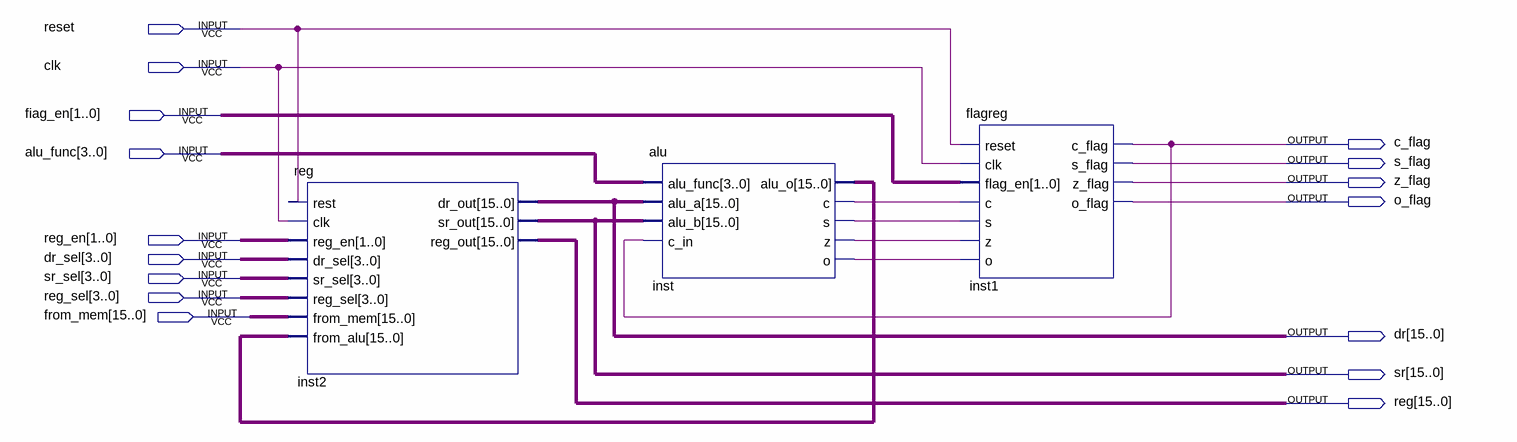
[diagram p0: schematic sheet]
// Quartus schematic exe_unit.bdf as structural Verilog: 3 symbols, 16 pins
module exe_unit (
  input  reset,
  input  clk,
  input  [1:0] fiag_en,
  input  [3:0] alu_func,
  input  [1:0] reg_en,
  input  [3:0] dr_sel,
  input  [3:0] sr_sel,
  input  [3:0] reg_sel,
  input  [15:0] from_mem,
  output c_flag,
  output s_flag,
  output z_flag,
  output o_flag,
  output [15:0] dr,
  output [15:0] sr,
  output [15:0] \reg 
);

  wire inst_c, inst_o, inst_s, inst_z;
  wire [15:0] inst_alu_o;

  \reg  inst2 (
    .rest(reset), .clk(clk), .reg_en(reg_en), .dr_sel(dr_sel), .sr_sel(sr_sel), .reg_sel(reg_sel),
    .from_mem(from_mem), .from_alu(inst_alu_o), .dr_out(dr), .sr_out(sr), .reg_out(\reg ));
  alu inst (
    .alu_func(alu_func), .alu_a(dr), .alu_b(sr), .c_in(c_flag), .alu_o(inst_alu_o), .c(inst_c), .s(inst_s),
    .z(inst_z), .o(inst_o));
  flagreg inst1 (
    .reset(reset), .clk(clk), .flag_en(fiag_en), .c(inst_c), .s(inst_s), .z(inst_z), .o(inst_o),
    .c_flag(c_flag), .s_flag(s_flag), .z_flag(z_flag), .o_flag(o_flag));
endmodule
